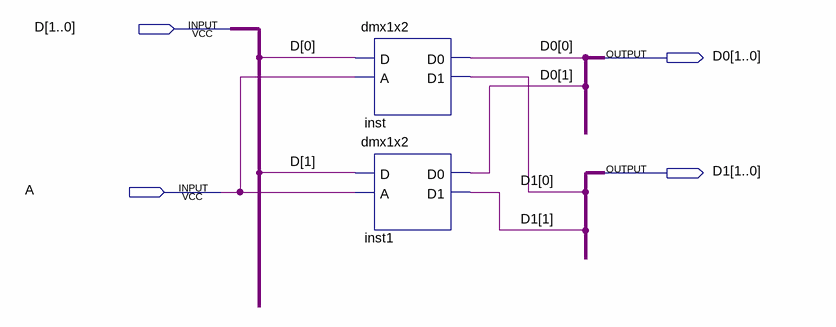
[diagram p0: schematic sheet]
// Quartus schematic DMX1x2R2.bdf as structural Verilog: 2 symbols, 4 pins
module DMX1x2R2 (
  input  [1:0] D,
  input  A,
  output [1:0] D0,
  output [1:0] D1
);

  dmx1x2 inst (.D(D[0]), .A(A), .D0(D0[0]), .D1(D1[0]));
  dmx1x2 inst1 (.D(D[1]), .A(A), .D0(D0[1]), .D1(D1[1]));
endmodule
